# EAGLE schematic ChargerV1.0 (EAGLE 7.7.0)
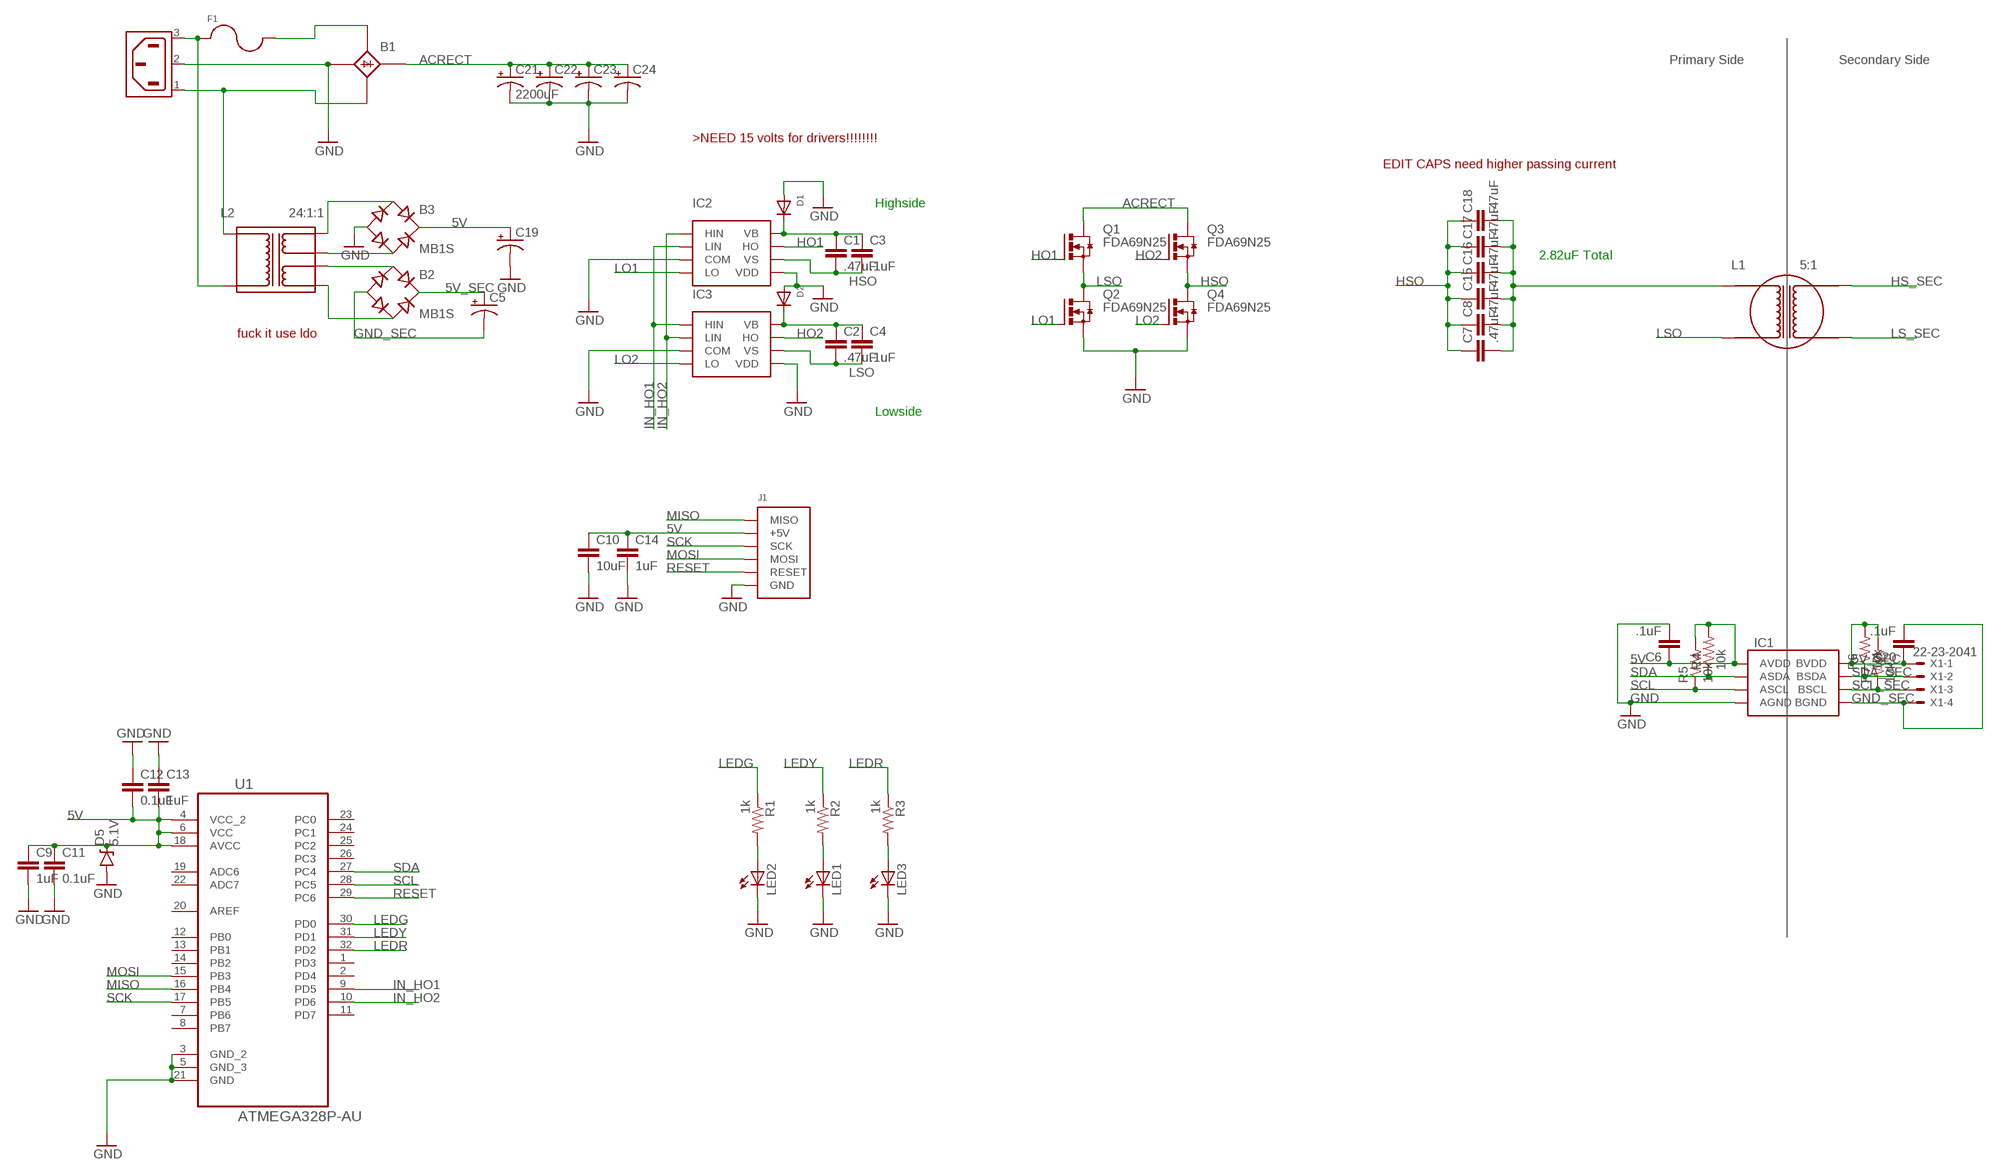
[diagram p0: schematic, sheet 1]

## Parts
B1  B25A-  [B25A-]
B2  MB1S  [SOIC-4]
B3  MB1S  [SOIC-4]
C1  .47uF  C-EUC1206  [C1206]
C2  .47uF  C-EUC1206  [C1206]
C3  .1uF  C-EUC1206  [C1206]
C4  .1uF  C-EUC1206  [C1206]
C5  CPOL-USE2.5-7  [E2,5-7]
C6  .1uF  10UF10V10%(0805)  [0805-CAP]
C7  .47uF  C-EUC1206  [C1206]
C8  .47uF  C-EUC1206  [C1206]
C9  1uF  0.33UF-50V-10%(0805)  [0805-CAP]
C10  10uF  10UF10V10%(0805)  [0805-CAP]
C11  0.1uF  0.33UF-50V-10%(0805)  [0805-CAP]
C12  0.1uF  0.33UF-50V-10%(0805)  [0805-CAP]
C13  1uF  0.33UF-50V-10%(0805)  [0805-CAP]
C14  1uF  0.33UF-50V-10%(0805)  [0805-CAP]
C15  .47uF  C-EUC1206  [C1206]
C16  .47uF  C-EUC1206  [C1206]
C17  .47uF  C-EUC1206  [C1206]
C18  .47uF  C-EUC1206  [C1206]
C19  CPOL-USE2.5-7  [E2,5-7]
C20  .1uF  10UF10V10%(0805)  [0805-CAP]
C21  2200uF  CPOL-USE10-30  [EB30D]
C22  CPOL-USE10-30  [EB30D]
C23  CPOL-USE10-30  [EB30D]
C24  CPOL-USE10-30  [EB30D]
D1  DIODESMA  [SMADIODE]
D2  DIODESMA  [SMADIODE]
D5  5.1V  DIODE-ZENER5.6V  [SOD-323]
F1  FUSE  [FUSE_HOLDER]
IC1  SI8600_DUALCHANNELISO  [SOIC-8]
IC2  FAN7190  [SOIC-8]
IC3  FAN7190  [SOIC-8]
J1  ISPHEADER  [2X3PIN_.1']
L1  5:1  TRANSFORMER  [TRANSFORMER_TOR_CUSTOM]
L2  24:1:1  TRANSFORMER1:2  [TRANSFORMER_CUSTOM1]
LED1  LEDCHIPLED_0805  [CHIPLED_0805]
LED2  LEDCHIPLED_0805  [CHIPLED_0805]
LED3  LEDCHIPLED_0805  [CHIPLED_0805]
Q1  FDA69N25  IRFP240  [TO247BV]
Q2  FDA69N25  IRFP240  [TO247BV]
Q3  FDA69N25  IRFP240  [TO247BV]
Q4  FDA69N25  IRFP240  [TO247BV]
R1  1k  0.3OHM-1/8W-1%(0805)  [0805]
R2  1k  0.3OHM-1/8W-1%(0805)  [0805]
R3  1k  0.3OHM-1/8W-1%(0805)  [0805]
R4  10k  0.3OHM-1/8W-1%(0805)  [0805]
R5  10k  0.3OHM-1/8W-1%(0805)  [0805]
R6  10k  0.3OHM-1/8W-1%(0805)  [0805]
R7  10k  0.3OHM-1/8W-1%(0805)  [0805]
U1  ATMEGA328P-AU  [QFP80P900X900X120-32N]
X1  22-23-2041  [22-23-2041]
X2  6ESRM-P  [6ESRM-P]

## Nets
5V: B3.+ C6.1 C9.1 C10.1 C11.1 C12.2 C13.2 C14.1 C19.+ D5.C IC1.P$1(AVDD) J1.P$2(+5V) R4.2 R5.2 U1.4(VCC_2) U1.6(VCC) U1.18(AVCC)
5V_SEC: B2.+ C5.+ C20.1 IC1.P$8(BVDD) R6.2 R7.2 X1.1
ACRECT: B1.+1(+) C21.+ C22.+ C23.+ C24.+ Q1.D Q3.D
GND: B1.-1(-) B3.- C6.2 C9.2 C10.2 C11.2 C12.1 C13.1 C14.2 C19.- C21.- C22.- C23.- C24.- D1.A D2.A D5.A IC1.P$4(AGND) IC2.P$3(COM) IC2.P$5(VDD) IC3.P$3(COM) IC3.P$5(VDD) J1.P$6(GND) LED1.C LED2.C LED3.C Q2.S Q4.S U1.3(GND_2) U1.5(GND_3) U1.21(GND) X2.2(SH)
GND_SEC: B2.- C5.- C20.2 IC1.P$5(BGND) X1.4
HO1: IC2.P$7(HO) Q1.G
HO2: IC3.P$7(HO) Q3.G
HS_SEC: L1.P$4
HSO: C1.2 C3.2 C7.1 C8.1 C15.1 C16.1 C17.1 C18.1 IC2.P$6(VS) Q3.S Q4.D
IN_HO1: IC2.P$2(LIN) IC3.P$1(HIN) U1.9(PD5)
IN_HO2: IC2.P$1(HIN) IC3.P$2(LIN) U1.10(PD6)
LEDG: R1.1 U1.30(PD0)
LEDR: R3.1 U1.32(PD2)
LEDY: R2.1 U1.31(PD1)
LO1: IC2.P$4(LO) Q2.G
LO2: IC3.P$4(LO) Q4.G
LS_SEC: L1.P$3
LSO: C2.2 C4.2 IC3.P$6(VS) L1.P$2 Q1.S Q2.D
MISO: J1.P$1(MISO) U1.16(PB4)
MOSI: J1.P$4(MOSI) U1.15(PB3)
N$1: F1.P$1 F1.P$2 L2.IN2 X2.3(AC2)
N$2: B1.AC1-(AC1) F1.P$3 F1.P$4
N$3: B1.AC2-(AC2) L2.IN1 X2.1(AC1)
N$4: B3.~1(AC1) L2.OUT11
N$5: B3.~2(AC2) L2.OUT12
N$6: B2.~1(AC1) L2.OUT21
N$7: B2.~2(AC2) L2.OUT22
N$8: LED2.A R1.2
N$9: LED1.A R2.2
N$10: C1.1 C3.1 D1.C IC2.P$8(VB)
N$11: C2.1 C4.1 D2.C IC3.P$8(VB)
N$12: LED3.A R3.2
N$13: C7.2 C8.2 C15.2 C16.2 C17.2 C18.2 L1.P$1
RESET: J1.P$5(RESET) U1.29(PC6)
SCK: J1.P$3(SCK) U1.17(PB5)
SCL: IC1.P$3(ASCL) R5.1 U1.28(PC5)
SCL_SEC: IC1.P$6(BSCL) R7.1 X1.3
SDA: IC1.P$2(ASDA) R4.1 U1.27(PC4)
SDA_SEC: IC1.P$7(BSDA) R6.1 X1.2
Unconnected: B1.+ B1.- B1.AC1 B1.AC2 U1.1(PD3) U1.2(PD4) U1.7(PB6) U1.8(PB7) U1.11(PD7) U1.12(PB0) U1.13(PB1) U1.14(PB2) U1.19(ADC6) U1.20(AREF) U1.22(ADC7) U1.23(PC0) U1.24(PC1) U1.25(PC2) U1.26(PC3)

## Notes on the sheet
- Primary Side | Secondary Side
- >NEED 15 volts for drivers!!!!!!!!
- EDIT CAPS need higher passing current
- Highside
- 2.82uF Total
- fuck it use ldo
- Lowside

## Library data of the parts
B1 = rectifier:B25A-: RECTIFIER 25-A bridge
B2 B3 = rectifier:MB*S: Bridge Rectifier Source: http://www.fairchildsemi.com/ds/MB/MB6S.pdf
C1-C4 C7 C8 C15-C18 = resistor:C-EU: CAPACITOR, European symbol
C5 C19 C21-C24 = rcl:CPOL-US: POLARIZED CAPACITOR, American symbol
C6 C10 C20 = SparkFun-Capacitors:10UF10V10%(0805): CAP-11330; PROD_ID: CAP-11330
C9 C11-C14 = SparkFun-Capacitors:0.33UF-50V-10%(0805): CAP-08469; PROD_ID: CAP-08469; VALUE: 0.33uF
D1 D2 = adafruit:DIODE: Diode SMADIODE - SMA Surface Mount Package 20V 1A Schottky Diode Digikey: 641-1014-6-ND DO-1N4148 - Through Hole Small Current Diode SOD-123 20V 1 A (.5mV Vf) Schottky Diode - Digikey: MBRX120TPMSCT-ND SOD-323 10V 570mA (.38mV Vf, 3ns) Schottky Diode - Digikey: ZLLS410CT-ND SOD-523 30V 30mA Schottky Diode (RB751S-40TE61) - Digikey: RB751S-40TE61CT-ND SOT23-R/W - SOT23 Package (R = Solder Paste/Reflow Ovens, W = Hand-Soldering) BAT54Film 40V 300mA - Digikey: 497-7162-1-ND
D5 = SparkFun-DiscreteSemi:DIODE-ZENER: Zener Diode Production Part - 8199 3.4V Zener Voltage; PROD_ID: DIO-12442; VALUE: 5.6V
F1 = lolomolo:FUSE
IC1 = lolomolo:SI8600_DUALCHANNELISO
IC2 IC3 = lolomolo:FAN7190
J1 = lolomolo:ISPHEADER
L1 = lolomolo:TRANSFORMER
L2 = lolomolo:TRANSFORMER1:2
LED1-LED3 = adafruit:LED: LED OSRAM: - CHIPLED LG R971, LG N971, LY N971, LG Q971, LY Q971, LO R971, LY R971 LH N974, LH R974 LS Q976, LO Q976, LY Q976 LO Q996 - Hyper CHIPLED LW Q18S LB Q993, LB Q99A, LB R99A - SideLED LS A670, LO A670, LY A670, LG A670, LP A670 LB A673, LV A673, LT A673, LW A673 LH A674 LY A675 LS A676, LA A676, LO A676, LY A676, LW A676 LS A679, LY A679, LG A679 - Hyper Micro SIDELED® LS Y876, LA Y876, LO Y876, LY Y876 LT Y87S - SmartLED LW L88C, LW L88S LB L89C, LB L89S, LG L890 LS L89K, LO L89K, LY L89K LS L896, LA L896, LO L896, LY L896 - TOPLED LS T670, LO T670, LY T670, LG T670, LP T670 LSG T670, LSP T670, LSY T670, LOP T670, LYG T670 LG T671, LOG T671, LSG T671 LB T673, LV T673, LT T673, LW T673 LH T674 LS T676, LA T676, LO T676, LY T676, LB T676, LH T676, LSB T676, LW T676 LB T67C, LV T67C, LT T67C, LS T67K, LO T67K, LY T67K, LW E67C LS E67B, LA E67B, LO E67B, LY E67B, LB E67C, LV E67C, LT E67C LW T67C LS T679, LY T679, LG T679 LS T770, LO T770, LY T770, LG T770, LP T770 LB T773, LV T773, LT T773, LW T773 LH T774 LS E675, LA E675, LY E675, LS T675 LS T776, LA T776, LO T776, LY T776, LB T776 LHGB T686 LT T68C, LB T68C - Hyper Mini TOPLED® LB M676 - Mini TOPLED Santana® LG M470 LS M47K, LO M47K, LY M47K Source: http://www.osram.convergy.de/
Q1-Q4 = transistor-power:IRFP240: HEXFET Power MosFet Source: http://www.irf.com/
R1-R7 = SparkFun-Resistors:0.3OHM-1/8W-1%(0805): RES-11622; PROD_ID: RES-11622; VALUE: 0.3
U1 = Atmel_By_element14_Batch_1-00:ATMEGA328P-AU: 8-bit Microcontroller with In-System Programmable Flash; MPN: ATMEGA328P-AU; OC_FARNELL: 1715486; OC_NEWARK: 14R4631; PACKAGE: TQFP-32; SUPPLIER: Atmel
X1 = con-molex:22-23-2041: .100" (2.54mm) Center Header - 4 Pin; MF: MOLEX; MPN: 22-23-2041; OC_FARNELL: 1462920; OC_NEWARK: 38C0355
X2 = con-tycoelectronics:6ESRM-P: AC Connector 120/250 VAC Source: http://catalog.tycoelectronics.com .. ENG_DS_1654001_1099_SR_0406.pdf; MF: TYCO ELECTRONICS; MPN: 6ESRM-P; OC_FARNELL: unknown; OC_NEWARK: 87F1821